# EAGLE board max10adc_v9.0 (EAGLE 9.2.0), part 1 of 3
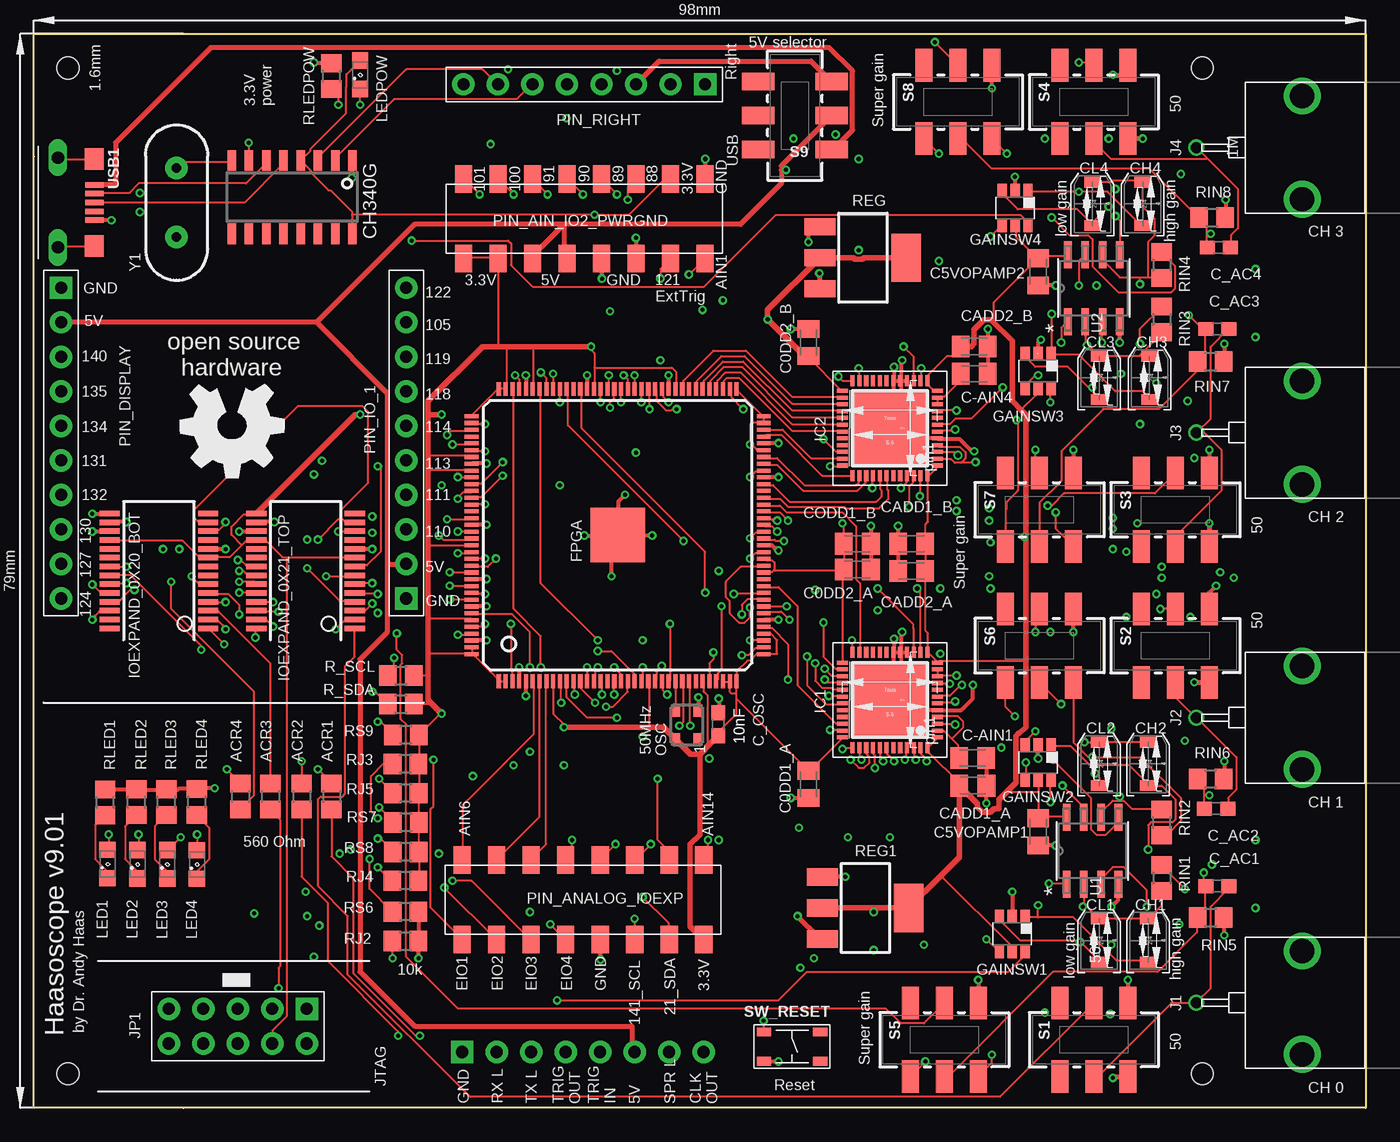
[diagram p3: board, top side]
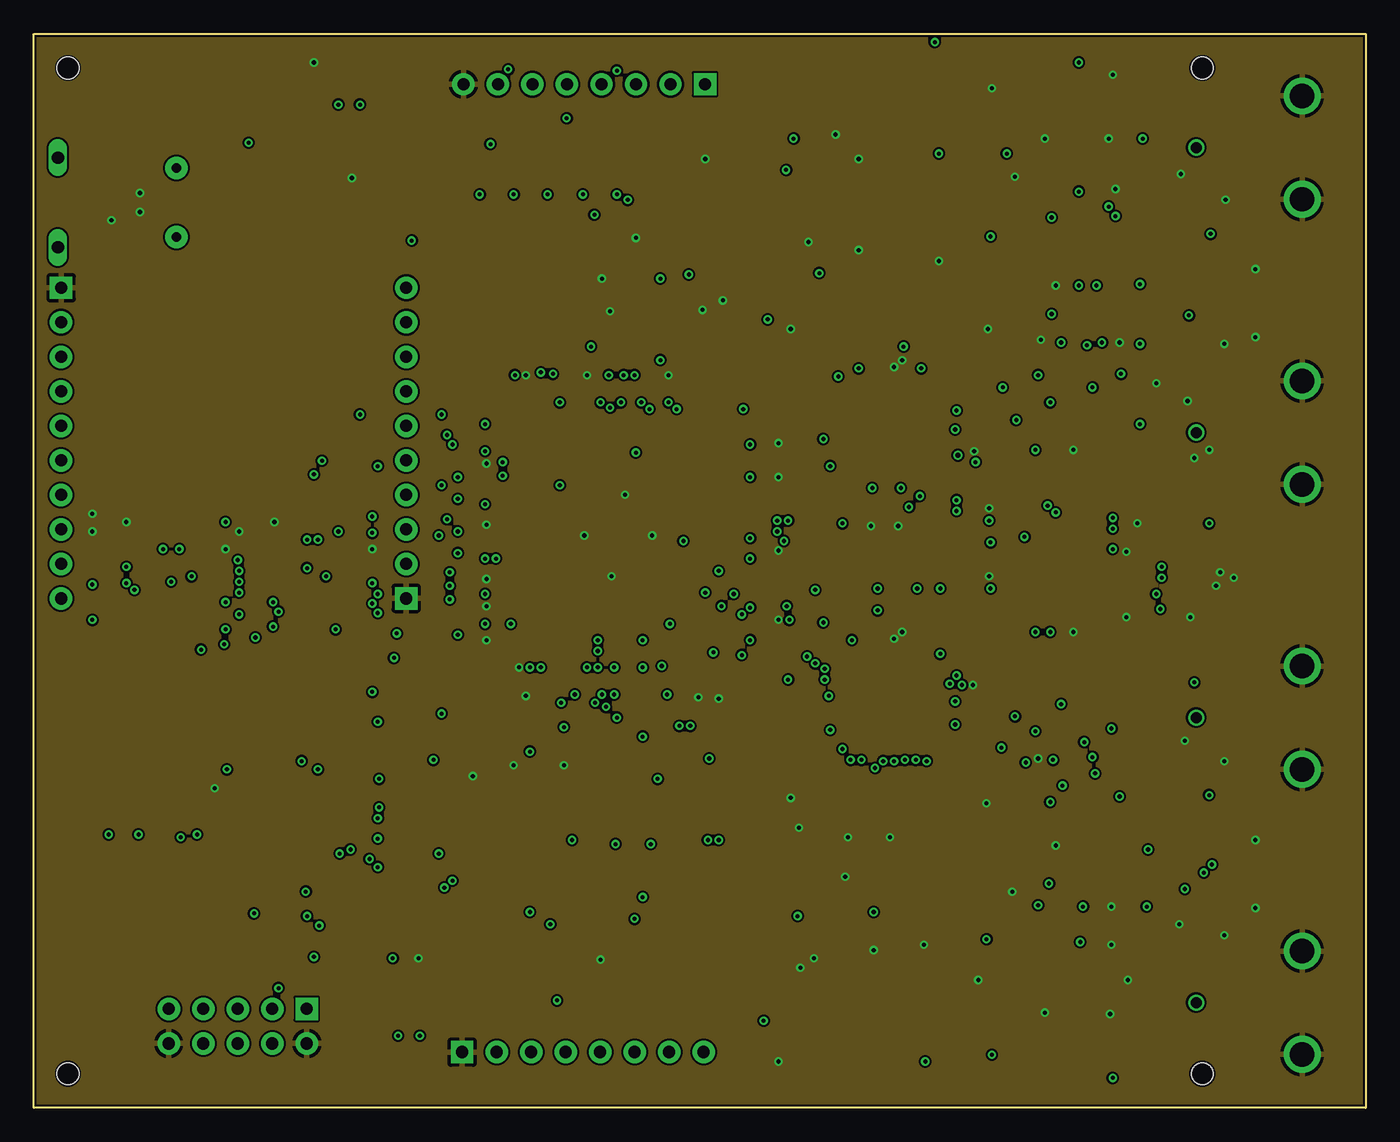
[diagram p4: board, inner layer Route2]
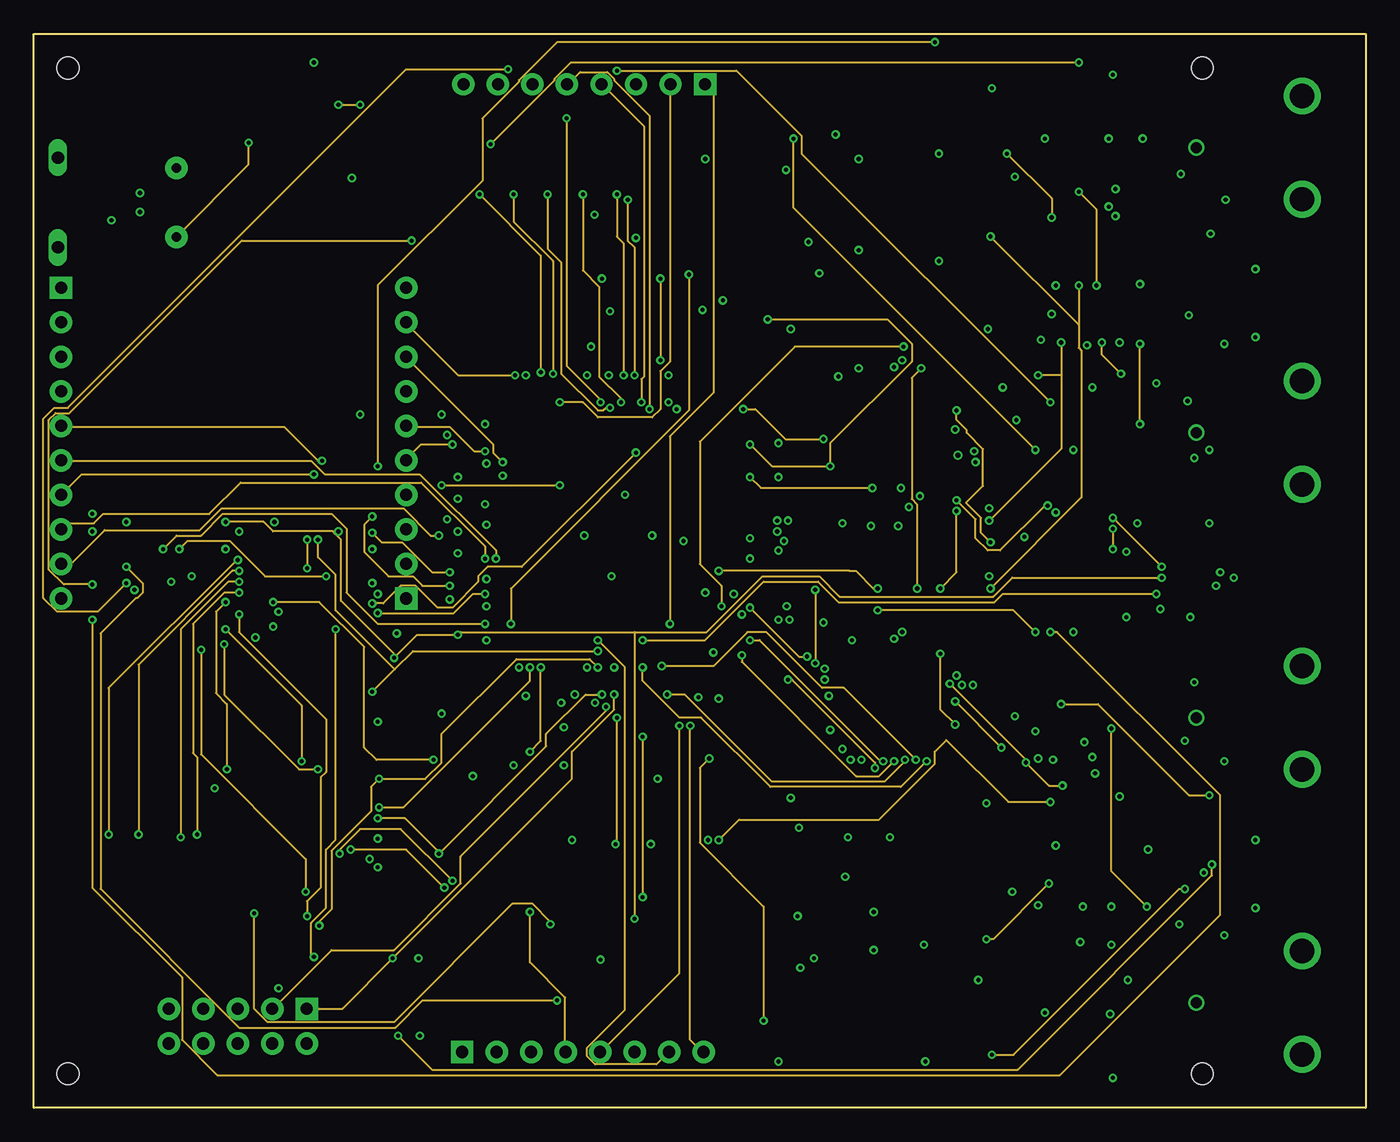
[diagram p5: board, inner layer Route15]
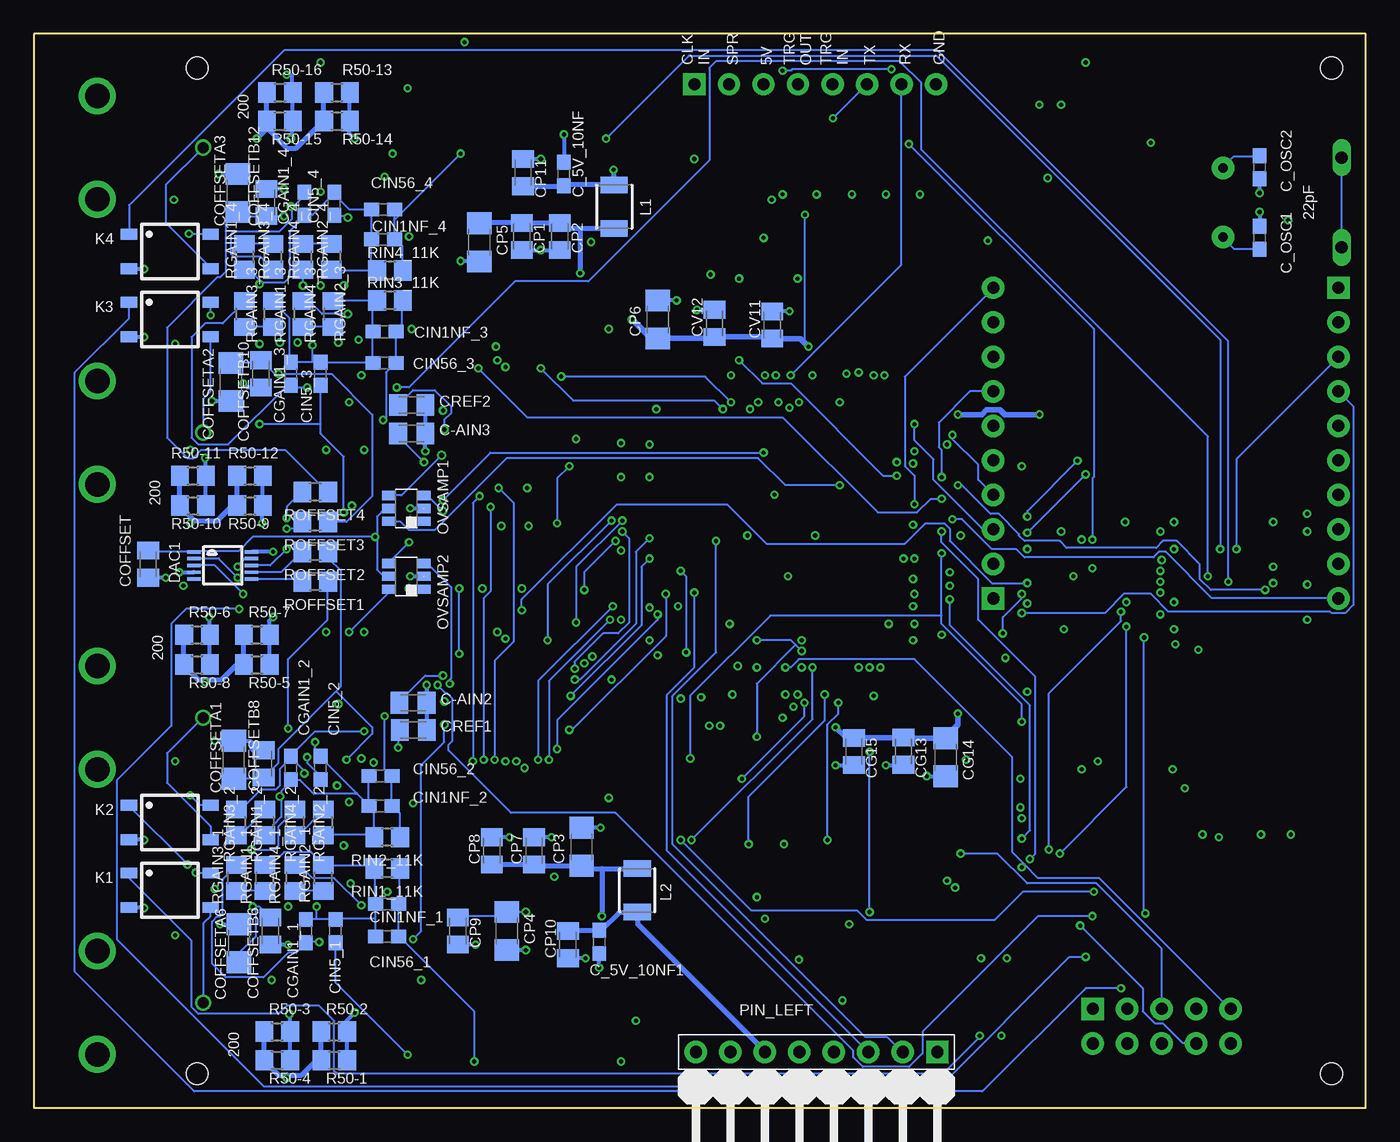
[diagram p6: board, bottom side, seen from below]

Size 98 x 79 mm. Coordinates in mm from the lower left corner, seen from the top.
Outline: 0,0 0,79 98,79 98,0 0,0
Copper layers (1*2*15*16): Top 0.035mm / dielectric 0.2mm / Route2 0.0175mm / dielectric 0.3mm / Route15 0.0175mm / dielectric 0.2mm / Bottom 0.035mm
Design rules "Seeed_AllPCB_MacroFab_haas6mil": minimum track width 6mil, minimum drill 12mil, track to track 6mil, track to pad 6mil, pad to pad 6mil, via to via 6mil, smd to smd 0mil, copper to edge 6mil, drill to drill 6mil, minimum pad ring 6mil, minimum via ring 6mil, stop-mask expansion 6mil, vias tented up to drill 25mil, thermal gap 10mil
Net classes: 0 default: width 0.152 mm; 1 gnd: width 0.305 mm; 2 three: width 0.152 mm; 3 five: width 0.381 mm
Holes 1.6 mm at 86,2.5 86,76.5 2.5,76.5 2.5,2.5

## Footprints (pad centres in the part's own frame; a part is rotated, then mirrored left to right if it is on the bottom)
R0805 = smd 1.3 x 1.5: 1 -0.95,0; 2 0.95,0
C0805K = smd 1.3 x 1.6: 1 -1,0; 2 1,0
C0603 = smd 1.1 x 1: 1 -0.85,0; 2 0.85,0
C1206 = smd 1.6 x 1.8: 1 -1.4,0; 2 1.4,0
CTZ3 = smd 1.2 x 0.8: + 0,1.598; - 0,-1.588
MSOP10 = smd 0.25 x 1: 1 -1,-2.113; 2 -0.5,-2.113; 3 0,-2.113; 4 0.5,-2.113; 5 1,-2.113; 6 1,2.113; 7 0.5,2.113; 8 0,2.113; 9 -0.5,2.113; 10 -1,2.113
EQFP144 = smd 1 x 0.3: 1 -10.75,8.75; 2 -10.75,8.25; 3 -10.75,7.75; 4 -10.75,7.25; 5 -10.75,6.75; 6 -10.75,6.25; 7 -10.75,5.75; 8 -10.75,5.25; 9 -10.75,4.75; 10 -10.75,4.25; 11 -10.75,3.75; 12 -10.75,3.25; 13 -10.75,2.75; 14 -10.75,2.25; 15 -10.75,1.75; 16 -10.75,1.25; 17 -10.75,0.75; 18 -10.75,0.25; 19 -10.75,-0.25; 20 -10.75,-0.75; 21 -10.75,-1.25; 22 -10.75,-1.75; 23 -10.75,-2.25; 24 -10.75,-2.75; 25 -10.75,-3.25; 26 -10.75,-3.75; 27 -10.75,-4.25; 28 -10.75,-4.75; 29 -10.75,-5.25; 30 -10.75,-5.75; 31 -10.75,-6.25; 32 -10.75,-6.75; 33 -10.75,-7.25; 34 -10.75,-7.75; 35 -10.75,-8.25; 36 -10.75,-8.75; 73 10.75,-8.75; 74 10.75,-8.25; 75 10.75,-7.75; 76 10.75,-7.25; 77 10.75,-6.75; 78 10.75,-6.25; 79 10.75,-5.75; 80 10.75,-5.25; 81 10.75,-4.75; 82 10.75,-4.25; 83 10.75,-3.75; 84 10.75,-3.25; 85 10.75,-2.75; 86 10.75,-2.25; 87 10.75,-1.75; 88 10.75,-1.25; 89 10.75,-0.75; 90 10.75,-0.25; 91 10.75,0.25; 92 10.75,0.75; 93 10.75,1.25; 94 10.75,1.75; 95 10.75,2.25; 96 10.75,2.75; 97 10.75,3.25; 98 10.75,3.75; 99 10.75,4.25; 100 10.75,4.75; 101 10.75,5.25; 102 10.75,5.75; 103 10.75,6.25; 104 10.75,6.75; 105 10.75,7.25; 106 10.75,7.75; 107 10.75,8.25; 108 10.75,8.75 | smd 0.3 x 1: 37 -8.75,-10.75; 38 -8.25,-10.75; 39 -7.75,-10.75; 40 -7.25,-10.75; 41 -6.75,-10.75; 42 -6.25,-10.75; 43 -5.75,-10.75; 44 -5.25,-10.75; 45 -4.75,-10.75; 46 -4.25,-10.75; 47 -3.75,-10.75; 48 -3.25,-10.75; 49 -2.75,-10.75; 50 -2.25,-10.75; 51 -1.75,-10.75; 52 -1.25,-10.75; 53 -0.75,-10.75; 54 -0.25,-10.75; 55 0.25,-10.75; 56 0.75,-10.75; 57 1.25,-10.75; 58 1.75,-10.75; 59 2.25,-10.75; 60 2.75,-10.75; 61 3.25,-10.75; 62 3.75,-10.75; 63 4.25,-10.75; 64 4.75,-10.75; 65 5.25,-10.75; 66 5.75,-10.75; 67 6.25,-10.75; 68 6.75,-10.75; 69 7.25,-10.75; 70 7.75,-10.75; 71 8.25,-10.75; 72 8.75,-10.75; 109 8.75,10.75; 110 8.25,10.75; 111 7.75,10.75; 112 7.25,10.75; 113 6.75,10.75; 114 6.25,10.75; 115 5.75,10.75; 116 5.25,10.75; 117 4.75,10.75; 118 4.25,10.75; 119 3.75,10.75; 120 3.25,10.75; 121 2.75,10.75; 122 2.25,10.75; 123 1.75,10.75; 124 1.25,10.75; 125 0.75,10.75; 126 0.25,10.75; 127 -0.25,10.75; 128 -0.75,10.75; 129 -1.25,10.75; 130 -1.75,10.75; 131 -2.25,10.75; 132 -2.75,10.75; 133 -3.25,10.75; 134 -3.75,10.75; 135 -4.25,10.75; 136 -4.75,10.75; 137 -5.25,10.75; 138 -5.75,10.75; 139 -6.25,10.75; 140 -6.75,10.75; 141 -7.25,10.75; 142 -7.75,10.75; 143 -8.25,10.75; 144 -8.75,10.75 | smd 4 x 4: E 0,0
DBV_R-PDSO-G6 = smd 0.69 x 0.99: 1 -0.95,-1.29; 2 0,-1.29; 3 0.95,-1.29; 4 0.95,1.3; 5 0,1.3; 6 -0.95,1.3
TQFP-48 = smd 0.8 x 0.3: 1 -3.5,2.75; 2 -3.5,2.25; 3 -3.5,1.75; 4 -3.5,1.25; 5 -3.5,0.75; 6 -3.5,0.25; 7 -3.5,-0.25; 8 -3.5,-0.75; 9 -3.5,-1.25; 10 -3.5,-1.75; 11 -3.5,-2.25; 12 -3.5,-2.75; 25 3.5,-2.75; 26 3.5,-2.25; 27 3.5,-1.75; 28 3.5,-1.25; 29 3.5,-0.75; 30 3.5,-0.25; 31 3.5,0.25; 32 3.5,0.75; 33 3.5,1.25; 34 3.5,1.75; 35 3.5,2.25; 36 3.5,2.75 | smd 0.3 x 0.8: 13 -2.75,-3.5; 14 -2.25,-3.5; 15 -1.75,-3.5; 16 -1.25,-3.5; 17 -0.75,-3.5; 18 -0.25,-3.5; 19 0.25,-3.5; 20 0.75,-3.5; 21 1.25,-3.5; 22 1.75,-3.5; 23 2.25,-3.5; 24 2.75,-3.5; 37 2.75,3.5; 38 2.25,3.5; 39 1.75,3.5; 40 1.25,3.5; 41 0.75,3.5; 42 0.25,3.5; 43 -0.25,3.5; 44 -0.75,3.5; 45 -1.25,3.5; 46 -1.75,3.5; 47 -2.25,3.5; 48 -2.75,3.5 | smd 5.588 x 5.588: EP_GND 0,0
SSOP28 = smd 0.4 x 1.5: 1 -4.225,-3.625; 2 -3.575,-3.625; 3 -2.925,-3.625; 4 -2.275,-3.625; 5 -1.625,-3.625; 6 -0.975,-3.625; 7 -0.325,-3.625; 8 0.325,-3.625; 9 0.975,-3.625; 10 1.625,-3.625; 11 2.275,-3.625; 12 2.925,-3.625; 13 3.575,-3.625; 14 4.225,-3.625; 15 4.225,3.625; 16 3.575,3.625; 17 2.925,3.625; 18 2.275,3.625; 19 1.625,3.625; 20 0.975,3.625; 21 0.325,3.625; 22 -0.325,3.625; 23 -0.975,3.625; 24 -1.625,3.625; 25 -2.275,3.625; 26 -2.925,3.625; 27 -3.575,3.625; 28 -4.225,3.625
MOLEX-BNC-73100-0105 = drill 1.8: GND1 -3.8,-3.9; GND2 3.8,-3.9 | drill 0.8: SIGNAL 0,3.9
H2X5-2.54 = drill 0.889 pad 1.651 square: 1 -1.27,5.08 | drill 0.889 pad 1.651: 2 -1.27,2.54; 3 -1.27,0; 4 -1.27,-2.54; 5 -1.27,-5.08; 6 1.27,-5.08; 7 1.27,-2.54; 8 1.27,0; 9 1.27,2.54; 10 1.27,5.08
SOP04 = smd 0.8 x 1.2: 1 -1.27,-3; 2 1.27,-3; 3 1.27,3; 4 -1.27,3
1210 = smd 1.2 x 2: 1 -1.6,0; 2 1.6,0
SML0805 = smd 1.2 x 1.2: A 1.05,0; C -1.05,0
ASE = smd 0.9 x 0.65: 1 -1.05,-0.825; 2 1.05,-0.825; 3 1.05,0.825; 4 -1.05,0.825
2X08_SMT = smd 1.27 x 2.032: 1 -8.89,-2.921; 2 -8.89,2.921; 3 -6.35,-2.921; 4 -6.35,2.921; 5 -3.81,-2.921; 6 -3.81,2.921; 7 -1.27,-2.921; 8 -1.27,2.921; 9 1.27,-2.921; 10 1.27,2.921; 11 3.81,-2.921; 12 3.81,2.921; 13 6.35,-2.921; 14 6.35,2.921; 15 8.89,-2.921; 16 8.89,2.921
H10-2.54 = drill 0.889 pad 1.651 square: 1 0,11.43 | drill 0.889 pad 1.651: 2 0,8.89; 3 0,6.35; 4 0,3.81; 5 0,1.27; 6 0,-1.27; 7 0,-3.81; 8 0,-6.35; 9 0,-8.89; 10 0,-11.43
H8-2.54-90D-MALE = drill 0.889 pad 1.651 square: 1 0,8.89 | drill 0.889 pad 1.651: 2 0,6.35; 3 0,3.81; 4 0,1.27; 5 0,-1.27; 6 0,-3.81; 7 0,-6.35; 8 0,-8.89
H8-2.54-90D-FEMALE = drill 0.889 pad 1.651 square: 1 0,8.89 | drill 0.889 pad 1.651: 2 0,6.35; 3 0,3.81; 4 0,1.27; 5 0,-1.27; 6 0,-3.81; 7 0,-6.35; 8 0,-8.89
SOT-223 = smd 1.27 x 2.286: 1 -2.286,-3.175; 2 0,-3.175; 3 2.286,-3.175 | smd 3.556 x 2.159: TER 0,3.175
JS202011SCQN = smd 1.27 x 2.4: 1 -2.5,-2.7; 2 0,-2.7; 3 2.5,-2.7; 4 -2.5,2.7; 5 0,2.7; 6 2.5,2.7
TACT4.2MM = smd 1.05 x 0.65: P$1 -2.075,1.075; P$2 2.075,1.075; P$3 -2.075,-1.075; P$4 2.075,-1.075
M08A = smd 1.981 x 0.559: 1 -2.464,1.905; 2 -2.464,0.635; 3 -2.464,-0.635; 4 -2.464,-1.905; 5 2.464,-1.905; 6 2.464,-0.635; 7 2.464,0.635; 8 2.464,1.905
SOIC16 = smd 0.635 x 1.524: 1 -4.445,-2.695; 2 -3.175,-2.695; 3 -1.905,-2.695; 4 -0.635,-2.695; 5 0.635,-2.695; 6 1.905,-2.695; 7 3.175,-2.695; 8 4.445,-2.695; 9 4.445,2.695; 10 3.175,2.695; 11 1.905,2.695; 12 0.635,2.695; 13 -0.635,2.695; 14 -1.905,2.695; 15 -3.175,2.695; 16 -4.445,2.695
10118193-0001LF = smd 0.4 x 1.35: 1 -1.3,2.54; 2 -0.65,2.54; 3 0,2.54; 4 0.65,2.54; 5 1.3,2.54 | drill 0.9 long: S1 -3.3,-0.135; S2 3.3,-0.135 | smd 1.6 x 1.4: S3 -3.2,2.54; S4 3.2,2.54
HC49US = drill 0.7 pad 1.651: 1 -2.54,0; 2 2.54,0

## Placement (x,y rotation side)
ACR1  560  [R0805]  21.9,22.9 270 top
ACR2  560  [R0805]  19.7,22.9 270 top
ACR3  560  [R0805]  17.4,22.9 270 top
ACR4  560  [R0805]  15.2,22.9 270 top
C0DD1_A  0.1uF  [C0805K]  57,23.8 270 top
C0DD2_A  0.1uF  [C0805K]  60.6,39.6 0 top
C0DD2_B  0.1uF  [C0805K]  57,56.3 90 top
C5VOPAMP1  0.1uF  [C0805K]  73.9,20.3 270 top
C5VOPAMP2  0.1uF  [C0805K]  73.9,61.5 270 top
C-AIN1  0.1uF  [C0805K]  69.08,25.74 0 top
C-AIN2  0.1uF  [C0805K]  70.1,29.8 0 bottom
C-AIN3  0.1uF  [C0805K]  70.2,49.6 0 bottom
C-AIN4  0.1uF  [C0805K]  69.2,54 0 top
C_5V_10NF  0.01uF  [C0603]  59,68.7 270 bottom
C_5V_10NF1  0.01uF  [C0603]  56.4,12.2 90 bottom
C_AC1  0.01uF  [C0603]  87.1,16.3 0 top
C_AC2  0.01uF  [C0603]  87,22 0 top
C_AC3  0.01uF  [C0603]  87.1,57.3 0 top
C_AC4  0.01uF  [C0603]  87.2,63.3 0 top
C_OSC  0.01uF  [C0603]  50.36,28.22 90 top
C_OSC1  22pF  [C0603]  7.8,64 90 bottom
C_OSC2  22pF  [C0603]  7.8,69.2 270 bottom
CADD1_A  0.1uF  [C0805K]  69.1,23.7 0 top
CADD1_B  0.1uF  [C0805K]  64.6,41.5 180 top
CADD2_A  0.1uF  [C0805K]  64.6,39.5 180 top
CADD2_B  0.1uF  [C0805K]  69.2,56 0 top
CG13  1uF  [C0805K]  34.01,26.23 270 bottom
CG14  10uF  [C1206]  30.91,25.79 270 bottom
CG15  0.1uF  [C0805K]  37.65,26.21 270 bottom
CGAIN1_1  33pF  [C0603]  78,13 270 bottom
CGAIN1_2  33pF  [C0603]  79.1,25 90 bottom
CGAIN1_3  33pF  [C0603]  79.1,54 270 bottom
CGAIN1_4  33pF  [C0603]  78.1,66.5 90 bottom
CH1  3-10pF  [CTZ3]  82,12.3 0 top
CH2  3-10pF  [CTZ3]  82,25.3 0 top
CH3  3-10pF  [CTZ3]  82.1,53.7 0 top
CH4  3-10pF  [CTZ3]  81.6,66.5 0 top
CIN1NF_1  1nF  [C0603]  72,15 180 bottom
CIN1NF_2  1nF  [C0603]  72.5,22.2 180 bottom
CIN1NF_3  1nF  [C0603]  72.2,57.1 180 bottom
CIN1NF_4  1nF  [C0603]  72.3,63.9 180 bottom
CIN5_1  10pF  [C0603]  75.8,13 90 bottom
CIN5_2  10pF  [C0603]  76.9,25 90 bottom
CIN5_3  10pF  [C0603]  76.9,54 90 bottom
CIN5_4  10pF  [C0603]  75.9,66.5 90 bottom
CIN56_1  56pF  [C0603]  72,12.6 180 bottom
CIN56_2  56pF  [C0603]  72.5,24.4 180 bottom
CIN56_3  56pF  [C0603]  72.2,54.8 180 bottom
CIN56_4  56pF  [C0603]  72.3,66.1 180 bottom
CL1  8-45pF  [CTZ3]  78.4,12.3 0 top
CL2  8-45pF  [CTZ3]  78.4,25.3 0 top
CL3  8-45pF  [CTZ3]  78.4,53.7 0 top
CL4  8-45pF  [CTZ3]  77.9,66.5 0 top
CODD1_B  0.1uF  [C0805K]  60.6,41.5 0 top
COFFSET  0.1uF  [C0805K]  89.6,40 90 bottom
COFFSETA1  10uF  [C1206]  83.3,25.6 270 bottom
COFFSETA2  10uF  [C1206]  83.5,53.4 90 bottom
COFFSETA3  10uF  [C1206]  83,67.3 270 bottom
COFFSETA6  10uF  [C1206]  82.9,12.1 270 bottom
COFFSETB6  0.1uF  [C0805K]  80.6,13 90 bottom
COFFSETB8  0.1uF  [C0805K]  81.1,25.3 270 bottom
COFFSETB10  0.1uF  [C0805K]  81.3,54 90 bottom
COFFSETB12  0.1uF  [C0805K]  80.9,66.6 270 bottom
CP1  1uF  [C0805K]  62.1,64.1 270 bottom
CP2  0.1uF  [C0805K]  59.3,64.1 270 bottom
CP3  10uF  [C1206]  57.7,19.2 90 bottom
CP4  10uF  [C1206]  63.2,13 270 bottom
CP5  10uF  [C1206]  65.22,63.67 270 bottom
CP6  10uF  [C1206]  52.08,58 90 bottom
CP7  1uF  [C0805K]  61.2,18.9 90 bottom
CP8  0.1uF  [C0805K]  64.3,18.9 90 bottom
CP9  1uF  [C0805K]  66.8,13 270 bottom
CP10  1uF  [C0805K]  58.7,12 90 bottom
CP11  1uF  [C0805K]  62,68.8 270 bottom
CREF1  0.1uF  [C0805K]  70.08,27.8 0 bottom
CREF2  0.1uF  [C0805K]  70.2,51.7 0 bottom
CV11  0.1uF  [C0805K]  43.67,57.59 90 bottom
CV12  1uF  [C0805K]  47.91,57.71 90 bottom
DAC1  MCP4728  [MSOP10]  84.1,39.9 270 bottom
FPGA  10M08SAE144  [EQFP144]  42.96,42.13 90 top
GAINSW1  741G3157DBVR  [DBV_R-PDSO-G6]  72,12.8 180 top
GAINSW2  741G3157DBVR  [DBV_R-PDSO-G6]  73.9,25.4 180 top
GAINSW3  741G3157DBVR  [DBV_R-PDSO-G6]  73.9,54.2 180 top
GAINSW4  741G3157DBVR  [DBV_R-PDSO-G6]  72.2,66.2 180 top
GOLD_ORB_SM1  OSHWLOGOLOGO8MM  [OSHW_8MM]  14.6,50.2 180 top
IC1  MAX19506  [TQFP-48]  63,30 180 top
IC2  MAX19506  [TQFP-48]  63,50 180 top
IOEXPAND_0X20_BOT  MCP23017SS  [SSOP28]  9.2,39.5 90 top
IOEXPAND_0X21_TOP  MCP23017SS  [SSOP28]  20,39.5 90 top
J1  MOLEX_BNC_73100-0105  [MOLEX-BNC-73100-0105]  89.44,7.73 90 top
J2  MOLEX_BNC_73100-0105  [MOLEX-BNC-73100-0105]  89.44,28.7 90 top
J3  MOLEX_BNC_73100-0105  [MOLEX-BNC-73100-0105]  89.44,49.67 90 top
J4  MOLEX_BNC_73100-0105  [MOLEX-BNC-73100-0105]  89.44,70.64 90 top
JP1  2x5p-2.54  [H2X5-2.54]  15,6 270 top
K1  AQY21SOP  [SOP04]  88,16 270 bottom
K2  AQY21SOP  [SOP04]  88,21 270 bottom
K3  AQY21SOP  [SOP04]  88,58 270 bottom
K4  AQY21SOP  [SOP04]  88,63 270 bottom
L1  10uH  [1210]  55.3,66.3 270 bottom
L2  10uH  [1210]  53.6,16 90 bottom
LED1  MF-LED-0805-RED  [SML0805]  5.42,17.93 90 top
LED2  MF-LED-0805-RED  [SML0805]  7.62,17.92 90 top
LED3  MF-LED-0805-RED  [SML0805]  9.82,17.91 90 top
LED4  MF-LED-0805-RED  [SML0805]  12,17.9 90 top
LEDPOW  MF-LED-0805-RED  [SML0805]  24,76 90 top
OSC  ASE-50.000MHZ-ET  [ASE]  48.04,28.16 90 top
OVSAMP1  741G3157DBVR  [DBV_R-PDSO-G6]  70.6,44.1 90 bottom
OVSAMP2  741G3157DBVR  [DBV_R-PDSO-G6]  70.6,39.1 90 bottom
PIN_AIN_IO2_PWRGND  15-91-2160  [2X08_SMT]  40.5,65.4 180 top
PIN_ANALOG_IOEXP  15-91-2160  [2X08_SMT]  40.4,15.3 0 top
PIN_DISPLAY  YELLOW-10P-2.54  [H10-2.54]  2,48.9 0 top
PIN_IO_1  YELLOW-10P-2.54  [H10-2.54]  27.4,48.9 180 top
PIN_LEFT  8p-2.54-90d  [H8-2.54-90D-MALE]  40.4,4.1 270 bottom
PIN_RIGHT  8p-2.54-90d  [H8-2.54-90D-FEMALE]  40.5,75.3 270 top
R50-1  200R  [R0805]  75.9,3.5 0 bottom
R50-2  200R  [R0805]  75.9,5.6 0 bottom
R50-3  200R  [R0805]  80.1,5.6 0 bottom
R50-4  200R  [R0805]  80.1,3.5 0 bottom
R50-5  200R  [R0805]  81.6,32.6 0 bottom
R50-6  200R  [R0805]  86,34.8 0 bottom
R50-7  200R  [R0805]  81.6,34.8 0 bottom
R50-8  200R  [R0805]  86,32.6 0 bottom
R50-9  200R  [R0805]  82.1,44.3 0 bottom
R50-10  200R  [R0805]  86.3,44.3 0 bottom
R50-11  200R  [R0805]  86.3,46.5 0 bottom
R50-12  200R  [R0805]  82.1,46.5 0 bottom
R50-13  200R  [R0805]  75.7,74.7 0 bottom
R50-14  200R  [R0805]  75.7,72.6 0 bottom
R50-15  200R  [R0805]  79.9,72.6 0 bottom
R50-16  200R  [R0805]  79.9,74.7 0 bottom
R_SCL  10K  [R0805]  27,31.8 0 top
R_SDA  10K  [R0805]  27,29.7 0 top
REG  LDL1117S33R  [SOT-223]  61.01,62.54 270 top
REG1  LDL1117S33R  [SOT-223]  61.2,14.7 270 top
RGAIN1_1  100k  [R0805]  81,16.9 90 bottom
RGAIN1_2  100k  [R0805]  81,21 270 bottom
RGAIN1_3  100k  [R0805]  80.4,58.4 90 bottom
RGAIN1_4  100k  [R0805]  82.5,62.6 270 bottom
RGAIN2_1  1M  [R0805]  76.7,16.9 90 bottom
RGAIN2_2  1M  [R0805]  76.7,21 270 bottom
RGAIN2_3  1M  [R0805]  76,58.4 90 bottom
RGAIN2_4  1M  [R0805]  76.1,62.6 270 bottom
RGAIN3_1  100k  [R0805]  83.1,16.9 270 bottom
RGAIN3_2  100k  [R0805]  83.1,21 270 bottom
RGAIN3_3  100k  [R0805]  82.5,58.4 270 bottom
RGAIN3_4  100k  [R0805]  80.4,62.6 90 bottom
RGAIN4_1  1M  [R0805]  78.8,16.9 270 bottom
RGAIN4_2  1M  [R0805]  78.8,21 270 bottom
RGAIN4_3  1M  [R0805]  78.2,58.4 270 bottom
RGAIN4_4  1M  [R0805]  78.2,62.6 90 bottom
RIN1  1.1M  [R0805]  83,16.9 270 top
RIN1_11K  11K  [R0805]  72,17.6 180 bottom
RIN2  1.1M  [R0805]  83,21 90 top
RIN2_11K  11K  [R0805]  72,19.9 180 bottom
RIN3  1.1M  [R0805]  83,58 270 top
RIN3_11K  11K  [R0805]  71.8,59.4 180 bottom
RIN4  1.1M  [R0805]  83,62 270 top
RIN4_11K  11K  [R0805]  71.8,61.6 180 bottom
RIN5  10M  [R0805]  86.6,14 0 top
RIN6  10M  [R0805]  86.6,24.2 0 top
RIN7  10M  [R0805]  86.6,54.9 0 top
RIN8  10M  [R0805]  86.7,65.5 0 top
RJ2  10K  [R0805]  27.33,12.26 0 top
RJ3  10K  [R0805]  27.34,25.3 180 top
RJ4  10K  [R0805]  27.33,16.7 180 top
RJ5  10K  [R0805]  27.36,23.14 180 top
RLED1  560  [R0805]  5.24,22.47 90 top
RLED2  560  [R0805]  7.54,22.48 90 top
RLED3  560  [R0805]  9.74,22.49 90 top
RLED4  560  [R0805]  12,22.5 90 top
RLEDPOW  560  [R0805]  21.9,75.9 90 top
ROFFSET1  200  [R0805]  77.3,38.7 180 bottom
ROFFSET2  200R  [R0805]  77.3,40.9 180 bottom
ROFFSET3  200R  [R0805]  77.3,43.1 180 bottom
ROFFSET4  200R  [R0805]  77.3,45.3 180 bottom
RS6  10K  [R0805]  27.34,14.42 180 top
RS7  10K  [R0805]  27.37,20.98 180 top
RS8  10K  [R0805]  27.36,18.82 180 top
RS9  10K  [R0805]  27.37,27.42 180 top
S1  JS202011SCQN  [JS202011SCQN]  78,5 0 top
S2  JS202011SCQN  [JS202011SCQN]  84,34 0 top
S3  JS202011SCQN  [JS202011SCQN]  84,44 0 top
S4  JS202011SCQN  [JS202011SCQN]  78,74 0 top
S5  JS202011SCQN  [JS202011SCQN]  67,5 0 top
S6  JS202011SCQN  [JS202011SCQN]  74,34 0 top
S7  JS202011SCQN  [JS202011SCQN]  74,44 0 top
S8  JS202011SCQN  [JS202011SCQN]  68,74 0 top
S9  JS202011SCQN  [JS202011SCQN]  56,73 90 top
SW_RESET  MF-SW-TACT-4.2MM  [TACT4.2MM]  55.8,4.5 180 top
U1  MAX4416ESA  [M08A]  77.9,18.9 90 top
U2  MAX4416ESA  [M08A]  78,60.3 90 top
U340G  CH340G  [SOIC16]  19,67 180 top
USB1  MF-CON-MICROUSB-RIGHT  [10118193-0001LF]  1.9,66.6 270 top
Y1  ABL-12.000MHZ-B2  [HC49US]  10.5,66.6 90 top